# EAGLE design XT-02_Eyecillator (EAGLE 9.5.1)
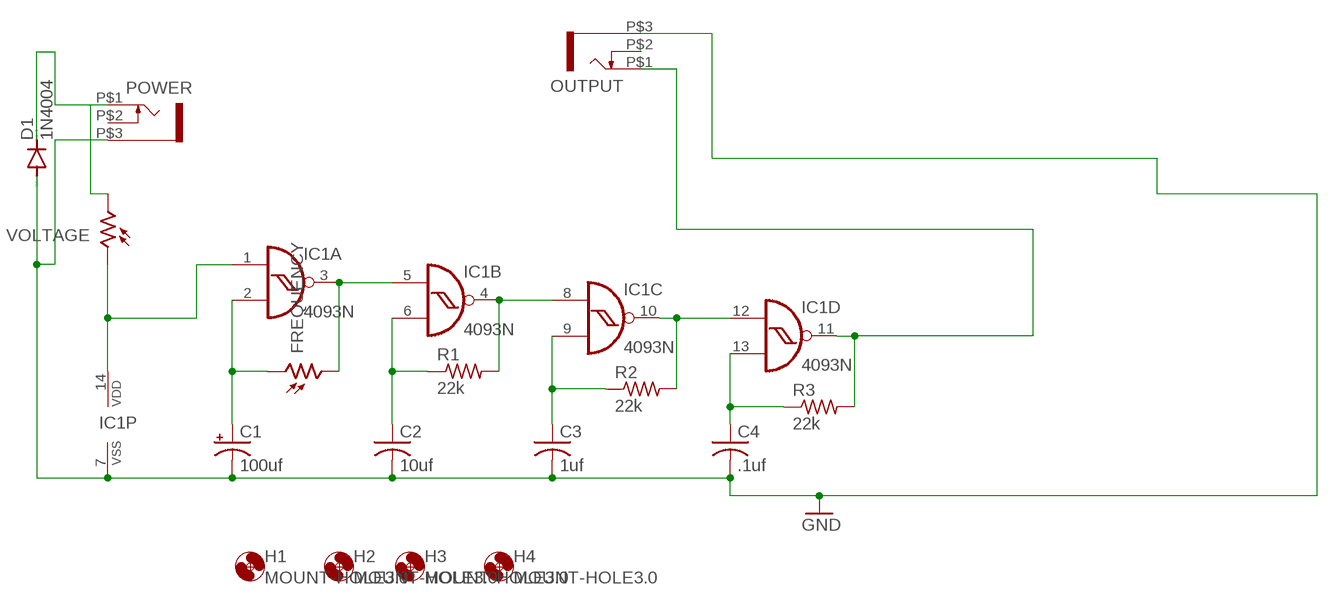
[diagram p0: schematic, sheet 1]

## Parts
C1  100uf  CPOL-USE2,5-6E  [E2,5-6E]
C2  10uf  C-US050-025X075  [C050-025X075]
C3  1uf  C-US050-025X075  [C050-025X075]
C4  .1uf  C-US050-025X075  [C050-025X075]
D1  1N4004  [DO41-10]
FREQUENCY  VT90N1  [VT900]
H1  MOUNT-HOLE3.0  [3,0]
H2  MOUNT-HOLE3.0  [3,0]
H3  MOUNT-HOLE3.0  [3,0]
H4  MOUNT-HOLE3.0  [3,0]
IC1  4093N  [DIL14]
OUTPUT  WQP-PJ301M-12_JACK  [WQP-PJ301M-12_JACK]
POWER  WQP-PJ301M-12_JACK  [WQP-PJ301M-12_JACK]
R1  22k  R-US_0207/7  [0207/7]
R2  22k  R-US_0207/7  [0207/7]
R3  22k  R-US_0207/7  [0207/7]
VOLTAGE  VT90N1  [VT900]

## Nets
GND: C1.- C2.2 C3.2 C4.2 D1.A IC1.7(P:VSS) OUTPUT.P$3 POWER.P$3
N$1: FREQUENCY.2 IC1.3(A:O) IC1.5(B:I0)
N$2: IC1.4(B:O) IC1.8(C:I0) R1.2
N$3: IC1.10(C:O) IC1.12(D:I0) R2.2
N$4: C1.+ FREQUENCY.1 IC1.2(A:I1)
N$5: C2.1 IC1.6(B:I1) R1.1
N$6: C3.1 IC1.9(C:I1) R2.1
N$7: C4.1 IC1.13(D:I1) R3.1
N$9: IC1.1(A:I0) IC1.14(P:VDD) VOLTAGE.1
N$10: IC1.11(D:O) OUTPUT.P$1 R3.2
N$18: D1.C POWER.P$1 VOLTAGE.2
Unconnected: OUTPUT.P$2 POWER.P$2

## Library data of the parts
C1 = rcl:CPOL-US: POLARIZED CAPACITOR, American symbol; SPICEPREFIX: C
C2-C4 = rcl:C-US: CAPACITOR, American symbol; SPICEPREFIX: C
D1 = diode:1N4004: DIODE general purpose rectifier, 1 A
FREQUENCY VOLTAGE = photo-elements:VT9: Photoconductive Cell VT900 Series Source: http://optoelectronics.perkinelmer.com/content/Datasheets/DTS_vt900seriesdatasheet.pdf
H1-H4 = holes:MOUNT-HOLE: MOUNTING HOLE with drill center marker
IC1 = 40xx:4093: Quad 2-input NAND schmitt trigger
OUTPUT POWER = thonkiconn:WQP-PJ301M-12_JACK
R1-R3 = rcl:R-US_: RESISTOR, American symbol; SPICEPREFIX: R

## Board
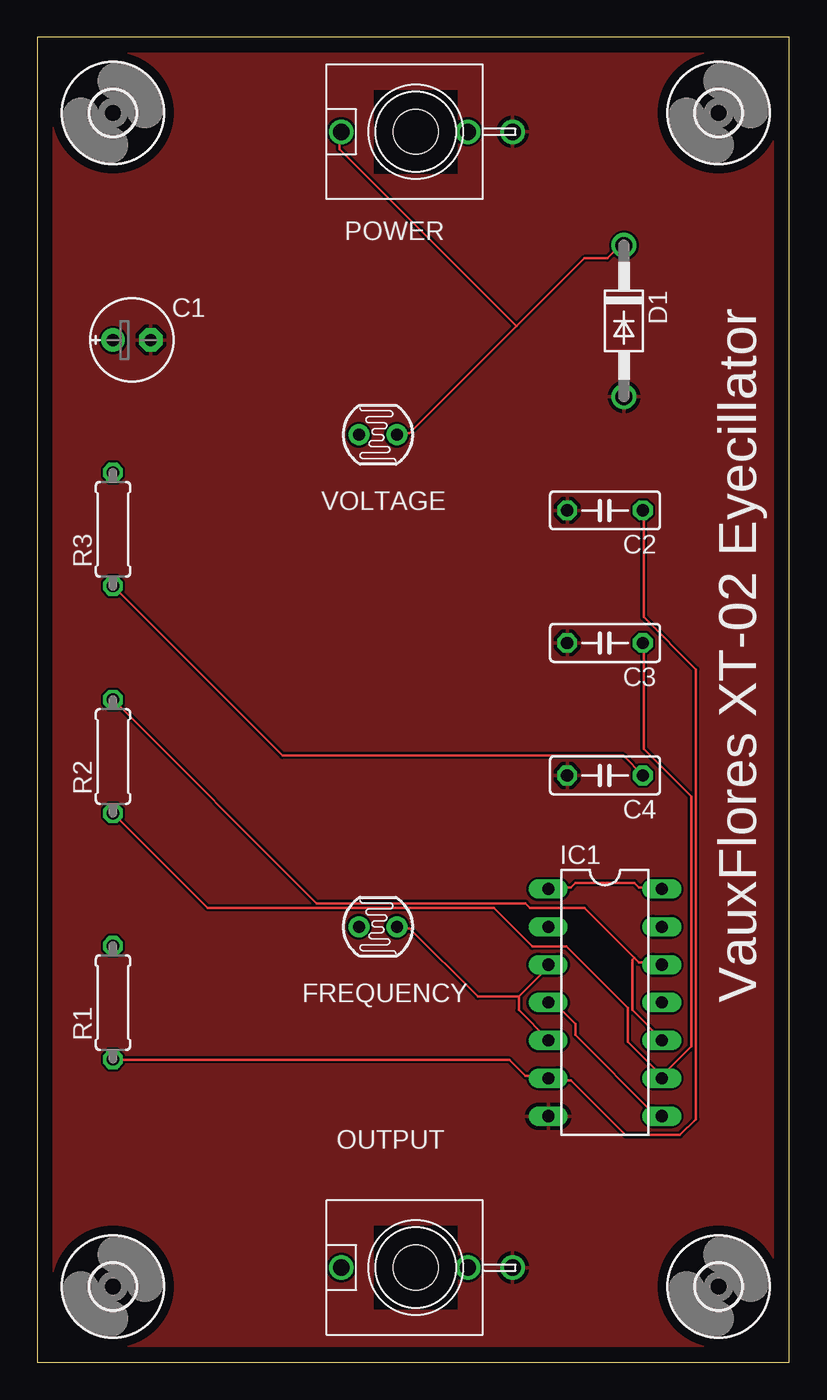
[diagram p1: board, top side]
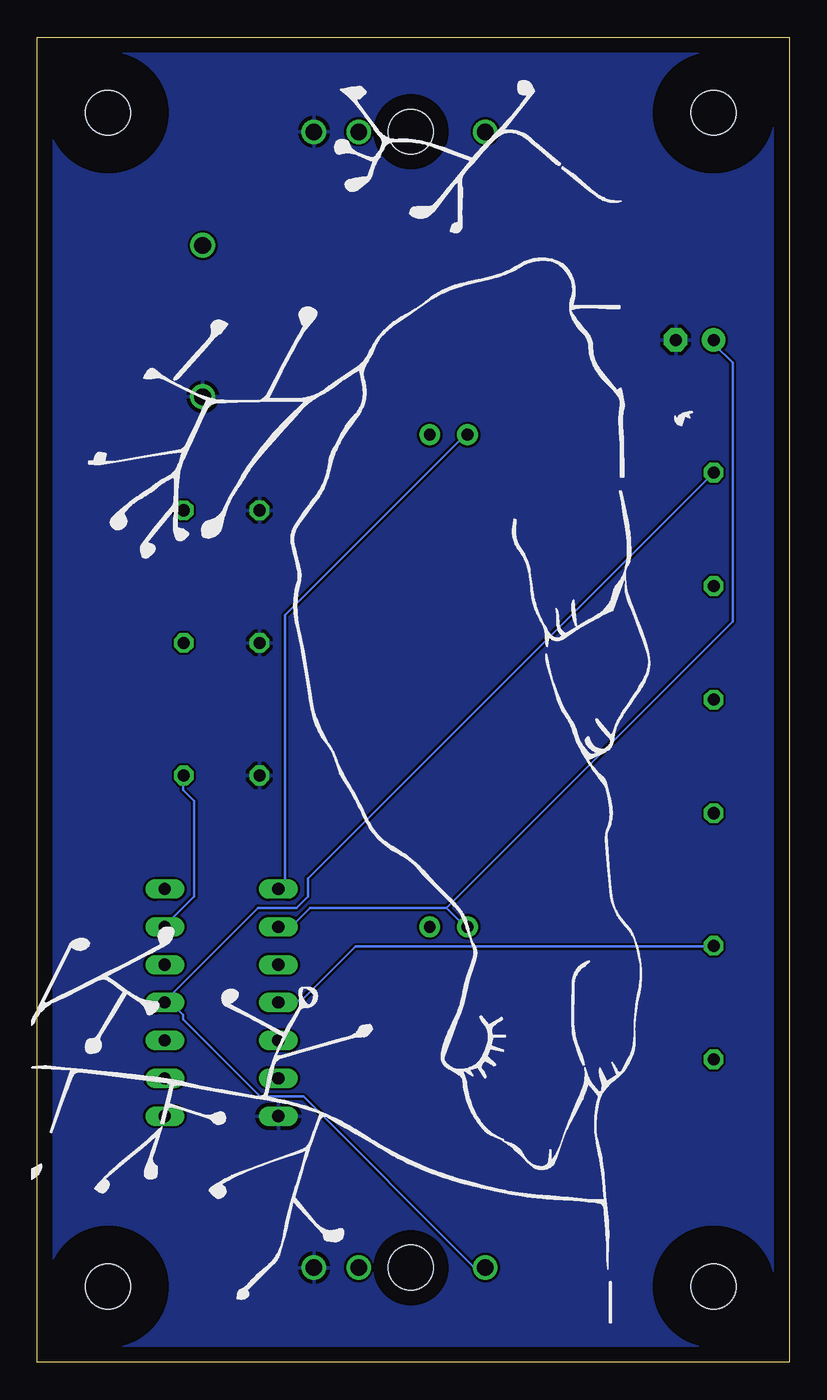
[diagram p2: board, bottom side, seen from below]

Size 50.47 x 88.89 mm. Coordinates in mm from the lower left corner, seen from the top.
Outline: 0,0 50.47,0 50.47,88.89 0,88.89 0,0
Copper layers (1*16): Top 0.035mm / dielectric 1.5mm / Bottom 0.035mm
Design rules "default": minimum track width 6mil, minimum drill 0.35mm, track to track 6mil, track to pad 6mil, pad to pad 6mil, via to via 6mil, smd to smd 6mil, copper to edge 40mil, drill to drill 6mil, minimum pad ring 10mil, minimum via ring 8mil, stop-mask expansion 4mil, vias tented up to drill 0mil, thermal gap 10mil
Holes 3 mm at 25.4,82.55 25.4,6.35

### Footprints (pad centres in the part's own frame; a part is rotated, then mirrored left to right if it is on the bottom)
E2,5-6E = drill 0.813 pad 1.575: + -1.27,0 | drill 0.813 pad 1.575 octagon: - 1.27,0
C050-025X075 = drill 0.813 octagon: 1 -2.54,0; 2 2.54,0
DO41-10 = drill 1.118: A 5.08,0; C -5.08,0
VT900 = drill 0.8 pad 1.4: 1 -1.27,0; 2 1.27,0
3,0 = hole 3: 0,0
DIL14 = drill 0.813 long: 1 -7.62,-3.81; 2 -5.08,-3.81; 3 -2.54,-3.81; 4 0,-3.81; 5 2.54,-3.81; 6 5.08,-3.81; 7 7.62,-3.81; 8 7.62,3.81; 9 5.08,3.81; 10 2.54,3.81; 11 0,3.81; 12 -2.54,3.81; 13 -5.08,3.81; 14 -7.62,3.81
WQP-PJ301M-12_JACK = drill 1.1: P$1 0,5; P$2 0,-3.5; P$3 0,-6.5
0207/7 = drill 0.813 octagon: 1 -3.81,0; 2 3.81,0

### Placement (x,y rotation side)
C1  6.35,68.58 0 top
C2  38.1,57.15 180 top
C3  38.1,48.26 180 top
C4  38.1,39.37 180 top
D1  39.37,69.85 270 top
FREQUENCY  22.86,29.21 0 top
H1  45.72,83.82 0 top
H2  5.08,83.82 0 top
H3  45.72,5.08 0 top
H4  5.08,5.08 0 top
IC1  38.1,24.13 270 top
OUTPUT  25.4,6.35 90 top
POWER  25.4,82.55 90 top
R1  5.08,24.13 90 top
R2  5.08,40.64 90 top
R3  5.08,55.88 90 top
VOLTAGE  22.86,62.23 0 top

### Tracks (layer width: path | path; a pad name or v marks a point on that pad's centre or on a via)
GND
  pour Top: 0,88.9 50.8,88.9 50.8,0 0,0
  pour Bottom: 0,88.9 50.8,88.9 50.8,0 0,0
N$1
  Top 0.152: 32.31,24.54 32.31,23.62 34.29,21.64 IC1.5 | 32.31,24.54 34.29,26.52 IC1.3 | 32.31,24.54 29.57,24.54 24.99,29.11 24.23,29.11 FREQUENCY.2
N$2
  Top 0.152: IC1.8 41.91,16.61 41.45,16.61 36.12,21.95 36.12,22.71 34.75,24.08 34.29,24.08 IC1.4
  Bottom 0.152: R1.2 5.18,27.89 29.11,27.89 32.77,24.23 34.29,24.23 IC1.4
N$3
  Top 0.152: R2.2 18.75,30.79 32.77,30.79 33.07,30.48 36.73,30.48 40.08,27.13 | 40.08,27.13 40.39,26.82 41.76,26.82 IC1.12 | 40.08,27.13 39.93,26.98 39.93,23.62 41.91,21.64 IC1.10
N$4
  Bottom 0.152: 23.01,30.48 32.16,30.48 33.38,29.26 34.29,29.26 IC1.2 | 23.01,30.48 21.64,29.11 FREQUENCY.1 | 23.01,30.48 3.81,49.68 3.81,67.06 5.03,68.28 5.03,68.58 C1.+
N$5
  Top 0.152: R1.1 5.18,20.27 31.7,20.27 32.77,19.2 34.14,19.2 IC1.6 34.44,18.9 35.81,18.9 39.47,15.24 43.13,15.24 44.2,16.31 44.2,46.48 40.69,49.99 40.69,57.15 C2.1
N$6
  Top 0.152: R2.1 11.43,30.48 30.63,30.48 33.22,27.89 35.51,27.89 39.62,23.77 39.62,21.49 41.91,19.2 | 41.91,19.2 43.89,21.18 43.89,37.95 40.69,41.15 40.69,48.16 C3.1 | 41.91,19.2 IC1.9
N$7
  Top 0.152: R3.1 16.46,40.69 39.32,40.69 C4.1
  Bottom 0.152: IC1.13 41.91,29.26 39.93,31.24 39.93,37.64 40.69,38.41 40.69,39.32 C4.1
N$9
  Top 0.152: IC1.1 34.29,31.85 35.81,31.85 36.12,32.16 40.08,32.16 40.39,31.85 41.91,31.85 IC1.14
  Bottom 0.152: VOLTAGE.1 21.95,61.87 22.1,61.87 33.83,50.14 33.83,32.31 34.29,31.85 IC1.1
N$10
  Bottom 0.152: R3.2 32.31,32.46 32.31,31.24 33.07,30.48 35.66,30.48 41.76,24.38 | 41.76,24.38 41.91,24.23 IC1.11 41.76,24.38 | 41.76,24.38 40.69,23.32 40.69,23.01 35.51,17.83 32.61,17.83 21.18,6.4 20.42,6.4 OUTPUT.P$1
N$18
  Top 0.152: 32.16,69.49 36.73,74.07 38.25,74.07 39.01,74.83 39.32,74.83 D1.C | 32.16,69.49 24.99,62.33 24.23,62.33 VOLTAGE.2 | 32.16,69.49 20.27,81.38 20.27,82.45 POWER.P$1

### Text on the board
tNames: VauxFlores XT-02 Eyecillator